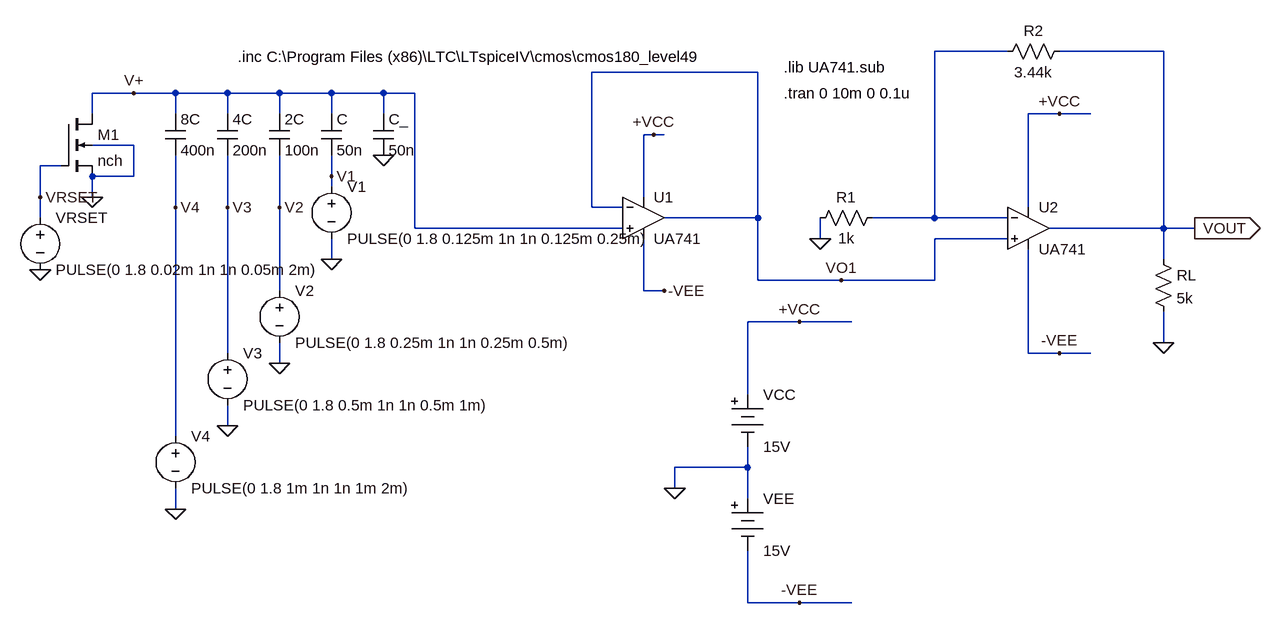
[diagram p0: schematic Lab3.asc]
Lab3.asc, the LTspice schematic file:
Version 4
SHEET 1 1972 972
WIRE 960 -64 848 -64
WIRE 1200 -64 1040 -64
WIRE 576 -32 320 -32
WIRE -384 0 -448 0
WIRE -320 0 -384 0
WIRE -240 0 -320 0
WIRE -160 0 -240 0
WIRE -80 0 -160 0
WIRE 0 0 -80 0
WIRE 48 0 0 0
WIRE -448 32 -448 0
WIRE -320 32 -320 0
WIRE -240 32 -240 0
WIRE -160 32 -160 0
WIRE -80 32 -80 0
WIRE 0 32 0 0
WIRE 1040 32 992 32
WIRE 1088 32 1040 32
WIRE 416 64 400 64
WIRE 432 64 416 64
WIRE -384 80 -448 80
WIRE -496 112 -528 112
WIRE -384 128 -384 80
WIRE -384 128 -448 128
WIRE -80 128 -80 96
WIRE -80 144 -80 128
WIRE -528 160 -528 112
WIRE -448 160 -448 128
WIRE 400 160 400 64
WIRE -320 176 -320 96
WIRE -240 176 -240 96
WIRE -160 176 -160 96
WIRE 320 176 320 -32
WIRE 368 176 320 176
WIRE 992 176 992 32
WIRE -528 192 -528 160
WIRE 576 192 576 -32
WIRE 576 192 432 192
WIRE 848 192 848 -64
WIRE 848 192 752 192
WIRE 960 192 848 192
WIRE 48 208 48 0
WIRE 368 208 48 208
WIRE 1200 208 1200 -64
WIRE 1200 208 1024 208
WIRE 1248 208 1200 208
WIRE 672 224 672 192
WIRE 960 224 848 224
WIRE -80 256 -80 224
WIRE 1200 256 1200 208
WIRE 576 288 576 192
WIRE 704 288 576 288
WIRE 848 288 848 224
WIRE 848 288 704 288
WIRE -160 304 -160 176
WIRE 400 304 400 224
WIRE 432 304 400 304
WIRE 640 352 560 352
WIRE 720 352 640 352
WIRE 1200 384 1200 336
WIRE -240 400 -240 176
WIRE 992 400 992 240
WIRE 1040 400 992 400
WIRE 1088 400 1040 400
WIRE -160 416 -160 384
WIRE 560 464 560 352
WIRE -240 512 -240 480
WIRE -320 528 -320 176
WIRE 560 576 560 544
WIRE 560 576 448 576
WIRE 448 608 448 576
WIRE 560 624 560 576
WIRE -320 640 -320 608
WIRE 560 784 560 704
WIRE 640 784 560 784
WIRE 720 784 640 784
FLAG 1248 208 VOUT
IOPIN 1248 208 Out
FLAG 448 608 0
FLAG 640 352 +VCC
FLAG 1040 32 +VCC
FLAG 640 784 -VEE
FLAG 1040 400 -VEE
FLAG 1200 384 0
FLAG 416 64 +VCC
FLAG 432 304 -VEE
FLAG 672 224 0
FLAG 0 96 0
FLAG -320 640 0
FLAG -240 512 0
FLAG -160 416 0
FLAG -80 256 0
FLAG -448 160 0
FLAG -528 272 0
FLAG -384 0 V+
FLAG -320 176 V4
FLAG -240 176 V3
FLAG -160 176 V2
FLAG -80 128 V1
FLAG -528 160 VRSET
FLAG 704 288 VO1
SYMBOL Opamps\\opamp2 992 144 R0
SYMATTR InstName U2
SYMATTR Value UA741
SYMBOL res 1184 240 R0
SYMATTR InstName RL
SYMATTR Value 5k
SYMBOL Misc\\battery 560 448 R0
SYMATTR InstName VCC
SYMATTR Value 15V
SYMBOL Misc\\battery 560 608 R0
SYMATTR InstName VEE
SYMATTR Value 15V
SYMBOL res 768 176 R90
WINDOW 0 0 56 VBottom 2
WINDOW 3 32 56 VTop 2
SYMATTR InstName R1
SYMATTR Value 1k
SYMBOL res 1056 -80 R90
WINDOW 0 0 56 VBottom 2
WINDOW 3 32 56 VTop 2
SYMATTR InstName R2
SYMATTR Value 3.44k
SYMBOL Opamps\\opamp2 400 128 R0
SYMATTR InstName U1
SYMATTR Value UA741
SYMBOL cap -16 32 R0
SYMATTR InstName C_
SYMATTR Value 50n
SYMBOL cap -96 32 R0
SYMATTR InstName C
SYMATTR Value 50n
SYMBOL cap -176 32 R0
SYMATTR InstName 2C
SYMATTR Value 100n
SYMBOL cap -256 32 R0
SYMATTR InstName 4C
SYMATTR Value 200n
SYMBOL voltage -80 128 R0
WINDOW 123 0 0 Left 2
WINDOW 39 0 0 Left 2
SYMATTR InstName V1
SYMATTR Value PULSE(0 1.8 0.125m 1n 1n 0.125m 0.25m)
SYMBOL voltage -160 288 R0
WINDOW 123 0 0 Left 2
WINDOW 39 0 0 Left 2
SYMATTR InstName V2
SYMATTR Value PULSE(0 1.8 0.25m 1n 1n 0.25m 0.5m)
SYMBOL voltage -240 384 R0
WINDOW 123 0 0 Left 2
WINDOW 39 0 0 Left 2
SYMATTR InstName V3
SYMATTR Value PULSE(0 1.8 0.5m 1n 1n 0.5m 1m)
SYMBOL voltage -320 512 R0
WINDOW 123 0 0 Left 2
WINDOW 39 0 0 Left 2
SYMATTR InstName V4
SYMATTR Value PULSE(0 1.8 1m 1n 1n 1m 2m)
SYMBOL cap -336 32 R0
SYMATTR InstName 8C
SYMATTR Value 400n
SYMBOL nmos4 -496 32 R0
SYMATTR InstName M1
SYMATTR Value nch
SYMATTR Value2 l=0.18u w=50u
SYMBOL voltage -528 176 R0
WINDOW 123 0 0 Left 2
WINDOW 39 0 0 Left 2
SYMATTR InstName VRSET
SYMATTR Value PULSE(0 1.8 0.02m 1n 1n 0.05m 2m)
TEXT 616 -40 Left 2 !.lib UA741.sub
TEXT 616 0 Left 2 !.tran 0 10m 0 0.1u
TEXT -224 -56 Left 2 !.inc C:\\Program Files (x86)\\LTC\\LTspiceIV\\cmos\\cmos180_level49

The netlist it stands for:
* Lab3.asc
XU2 VO1 N001 +VCC -VEE VOUT UA741  ; pins In+ In- V+ V- OUT
RL VOUT 0 5k
VCC +VCC 0 15V
VEE 0 -VEE 15V
R1 N001 0 1k
R2 VOUT N001 3.44k
XU1 V+ VO1 +VCC -VEE VO1 UA741  ; pins In+ In- V+ V- OUT
C_ V+ 0 50n
C V+ V1 50n
C§2C V+ V2 100n
C§4C V+ V3 200n
V1 V1 0 PULSE(0 1.8 0.125m 1n 1n 0.125m 0.25m)
V2 V2 0 PULSE(0 1.8 0.25m 1n 1n 0.25m 0.5m)
V3 V3 0 PULSE(0 1.8 0.5m 1n 1n 0.5m 1m)
V4 V4 0 PULSE(0 1.8 1m 1n 1n 1m 2m)
C§8C V+ V4 400n
M1 V+ VRSET 0 0 nch l=0.18u w=50u
VRSET VRSET 0 PULSE(0 1.8 0.02m 1n 1n 0.05m 2m)
.model NMOS NMOS
.model PMOS PMOS
.lib standard.mos
.lib UA741.sub
.tran 0 10m 0 0.1u
.inc C:\Program Files (x86)\LTC\LTspiceIV\cmos\cmos180_level49
.backanno
.end